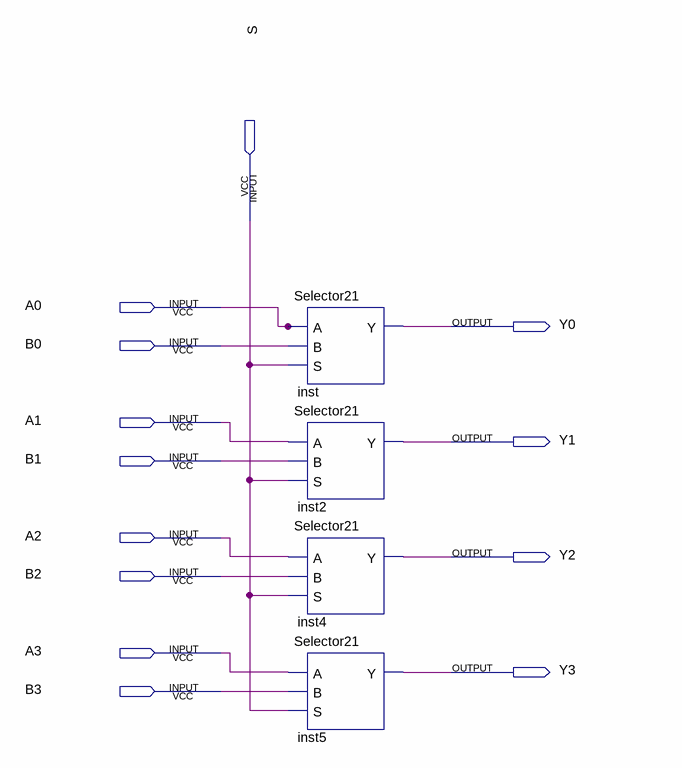
[diagram p0: schematic sheet]
// Quartus schematic QuadSelector21.bdf as structural Verilog: 4 symbols, 13 pins
module QuadSelector21 (
  input  S,
  input  A0,
  input  B0,
  input  A1,
  input  B1,
  input  A2,
  input  B2,
  input  A3,
  input  B3,
  output Y0,
  output Y1,
  output Y2,
  output Y3
);

  Selector21 inst (.A(A0), .B(B0), .S(S), .Y(Y0));
  Selector21 inst2 (.A(A1), .B(B1), .S(S), .Y(Y1));
  Selector21 inst4 (.A(A2), .B(B2), .S(S), .Y(Y2));
  Selector21 inst5 (.A(A3), .B(B3), .S(S), .Y(Y3));
endmodule
